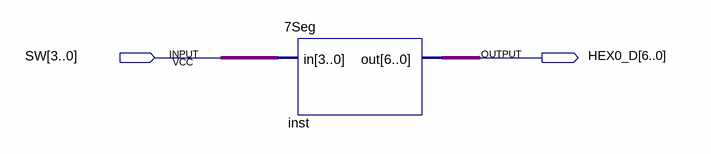
[diagram p0: schematic sheet]
// Quartus schematic My7Seg.bdf as structural Verilog: 1 symbols, 2 pins
module My7Seg (
  input  [3:0] SW,
  output [6:0] HEX0_D
);

  \7Seg  inst (.in(SW), .out(HEX0_D));
endmodule
